# EAGLE design FeatherBigLatchingRelay (EAGLE 7.4.0)
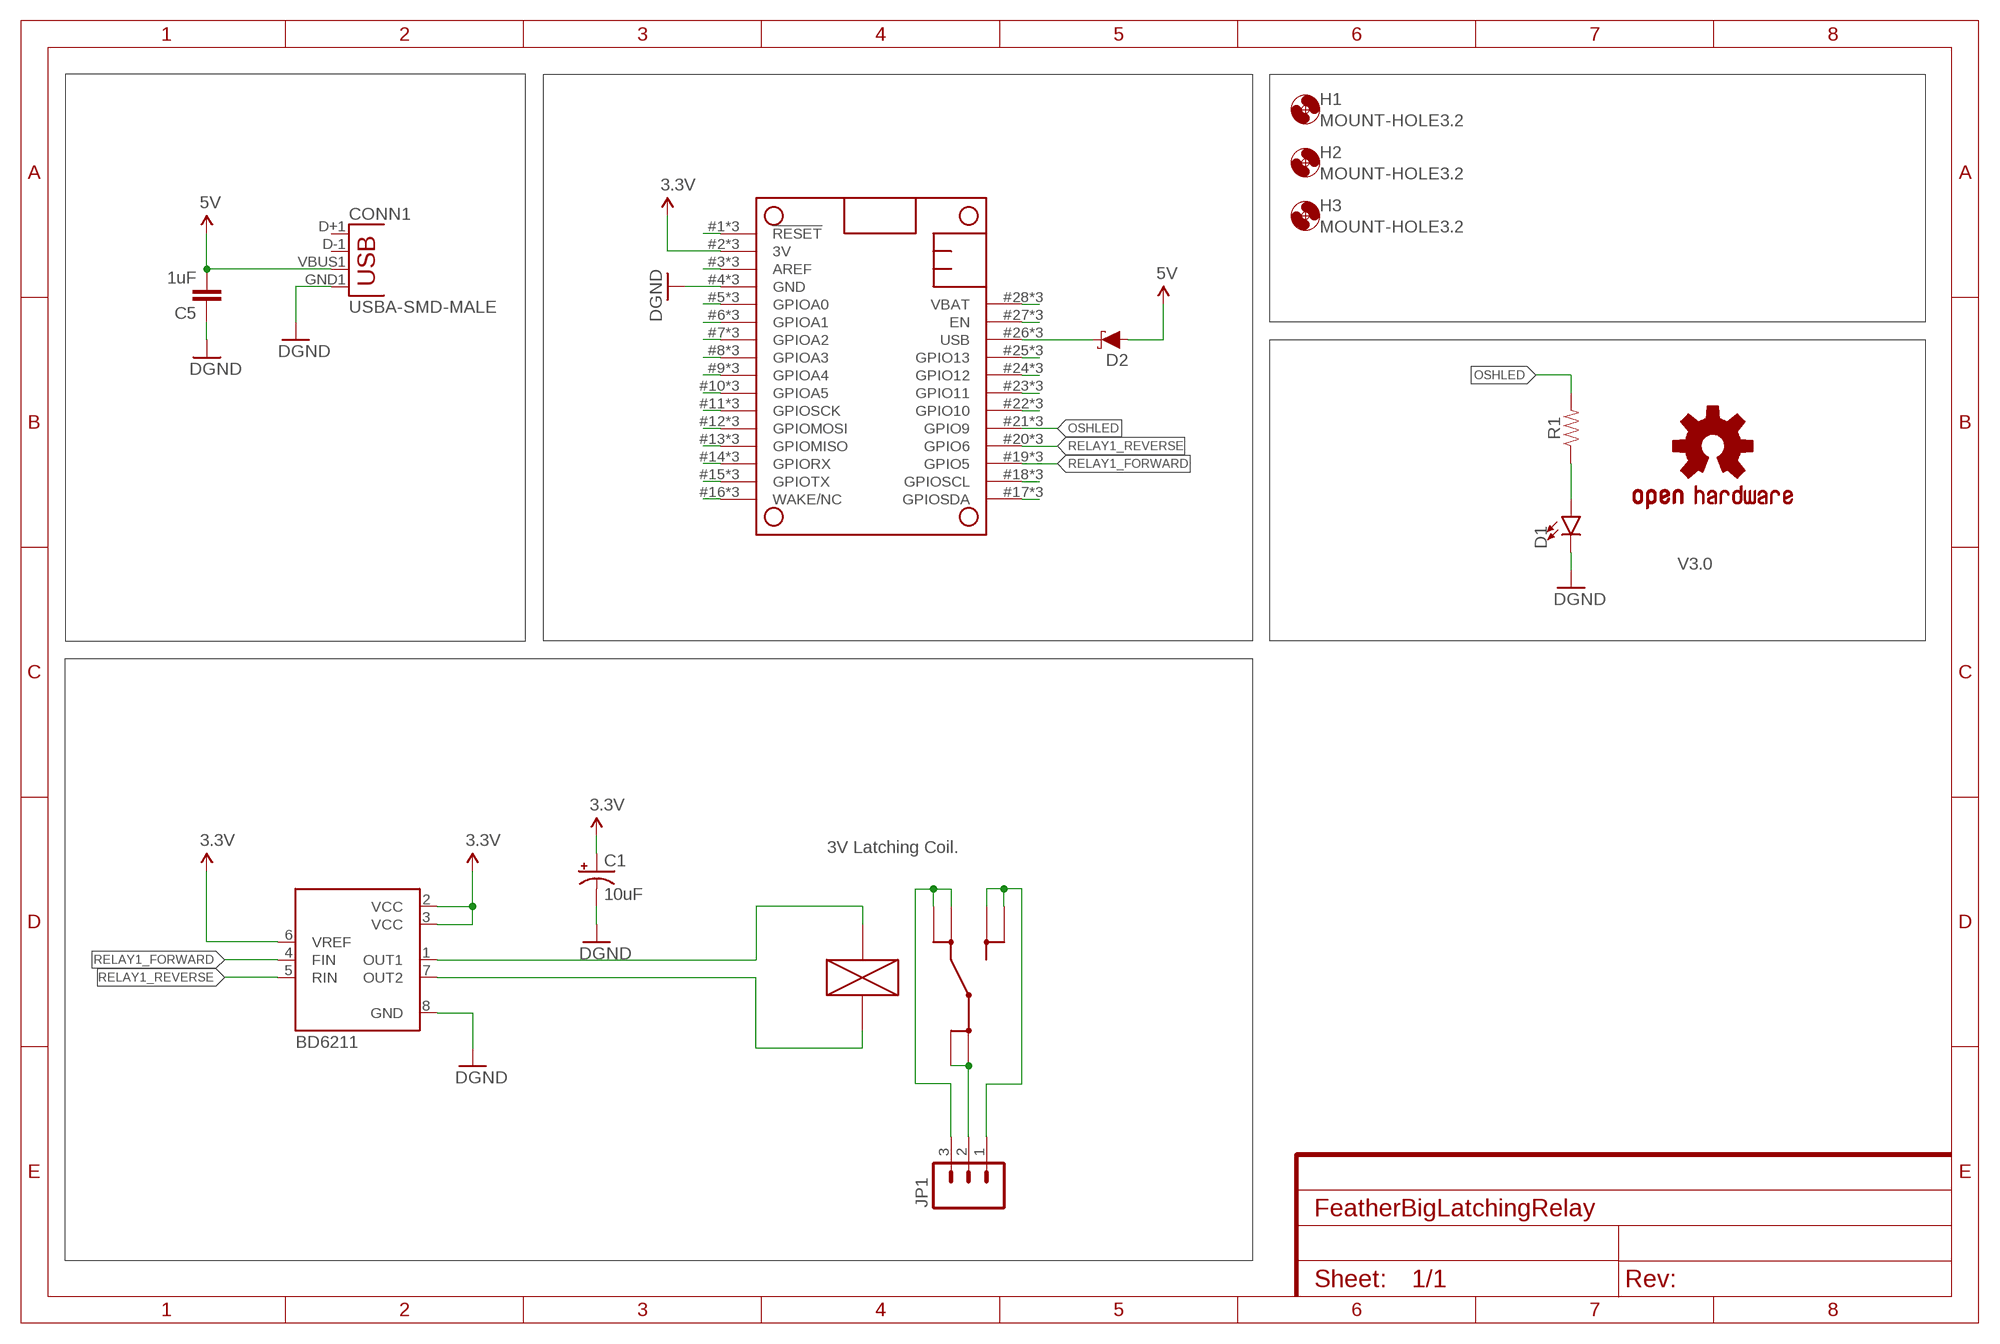
[diagram p0: schematic, sheet 1]

## Parts
C1  10uF  10UF-16V-10%(TANT)  [EIA3216]
C5  1uF  CAP0805  [0805]
CONN1  USBA-SMD-MALE  [USB-A-SMT-MALE]
D1  LED1206-BOTTOM  [LED-1206-BOTTOM]
D2  3A/40V/500mV  DIODE-SCHOTTKY-B340A  [SMA-DIODE]
H1  MOUNT-HOLE3.2  [3,2]
H2  MOUNT-HOLE3.2  [3,2]
H3  MOUNT-HOLE3.2  [3,2]
JP1  M03-SCREW-5MM  [SCREWTERMINAL-5MM-3]
LOGO1  OSHW-LOGOM  [OSHW-LOGO-M]
MS1  FEATHERWINGFEATHERWING_BREAKOUT_INSIDEONLY  [FEATHERWING_BREAKOUT_INSIDE_ONLY]
R1  RESISTOR1206  [1206]
U3  BD6211F  [SOP8]
U$1  RELAY_G5RL-1E  [G5RL-1E]

## Nets
3.3V: C1.A(+) MS1.2(3V) MS1.#2(3V) MS1.@2(3V) U3.2(VCC) U3.3(VCC) U3.6(VREF)
5V: C5.2 CONN1.VBUS1(VBUS) D2.A
GND: C1.C(-) C5.1 CONN1.GND1(GND) D1.C MS1.4(GND) MS1.#4(GND) MS1.@4(GND) U3.8(GND) ; supply symbol labelled DGND
N$1: JP1.2 U$1.COM@1(COM) U$1.COM@2(COM)
N$3: JP1.1 U$1.NO@1(NO) U$1.NO@2(NO)
N$4: JP1.3 U$1.NC@1(NC) U$1.NC@2(NC)
N$11: D1.A R1.1
N$12: U3.1(OUT1) U$1.COIL+
N$13: U3.7(OUT2) U$1.COIL-
N$30: MS1.22(GPIO10) MS1.#22(GPIO10) MS1.@22(GPIO10)
N$49: MS1.23(GPIO11) MS1.#23(GPIO11) MS1.@23(GPIO11)
N$50: MS1.24(GPIO12) MS1.#24(GPIO12) MS1.@24(GPIO12)
N$51: MS1.25(GPIO13) MS1.#25(GPIO13) MS1.@25(GPIO13)
N$52: MS1.27(EN) MS1.#27(EN) MS1.@27(EN)
N$53: MS1.1(!RESET) MS1.#1(!RESET) MS1.@1(!RESET)
N$54: MS1.3(AREF) MS1.#3(AREF) MS1.@3(AREF)
N$55: MS1.5(GPIOA0) MS1.#5(GPIOA0) MS1.@5(GPIOA0)
N$56: MS1.6(GPIOA1) MS1.#6(GPIOA1) MS1.@6(GPIOA1)
N$57: MS1.7(GPIOA2) MS1.#7(GPIOA2) MS1.@7(GPIOA2)
N$58: MS1.8(GPIOA3) MS1.#8(GPIOA3) MS1.@8(GPIOA3)
N$59: MS1.9(GPIOA4) MS1.#9(GPIOA4) MS1.@9(GPIOA4)
N$60: MS1.10(GPIOA5) MS1.#10(GPIOA5) MS1.@10(GPIOA5)
N$61: MS1.11(GPIOSCK) MS1.#11(GPIOSCK) MS1.@11(GPIOSCK)
N$62: MS1.12(GPIOMOSI) MS1.#12(GPIOMOSI) MS1.@12(GPIOMOSI)
N$63: MS1.13(GPIOMISO) MS1.#13(GPIOMISO) MS1.@13(GPIOMISO)
N$64: MS1.14(GPIORX) MS1.#14(GPIORX) MS1.@14(GPIORX)
N$65: MS1.15(GPIOTX) MS1.#15(GPIOTX) MS1.@15(GPIOTX)
N$66: MS1.16(WAKE/NC) MS1.#16(WAKE/NC) MS1.@16(WAKE/NC)
N$67: MS1.17(GPIOSDA) MS1.#17(GPIOSDA) MS1.@17(GPIOSDA)
N$68: MS1.18(GPIOSCL) MS1.#18(GPIOSCL) MS1.@!8(GPIOSCL)
OSHLED: MS1.21(GPIO9) MS1.#21(GPIO9) MS1.@21(GPIO9) R1.2
RELAY1_FORWARD: MS1.19(GPIO5) MS1.#19(GPIO5) MS1.@19(GPIO5) U3.4(FIN)
RELAY1_REVERSE: MS1.20(GPIO6) MS1.#20(GPIO6) MS1.@20(GPIO6) U3.5(RIN)
USB: D2.C MS1.26(USB) MS1.#26(USB) MS1.@26(USB)
VBAT: MS1.28(VBAT) MS1.#28(VBAT) MS1.@28(VBAT)
Unconnected: CONN1.D+1(D+) CONN1.D-1(D-)

## Notes on the sheet
- V3.0
- 3V Latching Coil.
- BD6211

## Library data of the parts
C1 = SparkFun-Capacitors:10UF-16V-10%(TANT): CAP-00811 1206/EIA-3216 Tantalum capacitor; PROD_ID: CAP-00811
C5 = SparkFun-Passives:CAP: Capacitor Standard 0603 ceramic capacitor, and 0.1" leaded capacitor.
CONN1 = SparkFun-Connectors:USB: USB Connectors USB-B-PTH is fully proven SKU : PRT-00139/CONN-08278 USB-miniB is fully proven SKU : PRT-00587 USB-A-PCB is untested. USB-A-H is throughly reviewed, but untested. Spark Fun Electronics SKU : PRT-00437 USB-B-SMT is throughly reviewed, but untested. Needs silkscreen touching up. USB-A-S has not been used/tested USB-MB-H has not been used/tested USB-MICROB has been used. CONN-09505
D1 = SparkFun-LED:LED: LED (Generic) Standard schematic elements and footprints for 5mm, 3mm, 1206, and 0603 sized LEDs. Generic LEDs with no color specified.
D2 = SparkFun-DiscreteSemi:DIODE-SCHOTTKY: Schottky diode A Schottky diode is a semiconductor diode which has a low forward voltage drop and a very fast switching action.; PROD_ID: DIO-09886
H1-H3 = holes:MOUNT-HOLE: MOUNTING HOLE with drill center marker
JP1 = SparkFun-Connectors:M03: Header 3 Standard 3-pin 0.1" header. Use with straight break away headers (SKU : PRT-00116), right angle break away headers (PRT-00553), swiss pins (PRT-00743), machine pins (PRT-00117), and female headers (PRT-00115). Molex polarized connector foot print use with SKU : PRT-08232 with associated crimp pins and housings.; STOREFRONT_ID: PRT-08433
LOGO1 = SparkFun-Aesthetics:OSHW-LOGO: Open-Source Hardware (OSHW) Logo This logo indicates the piece of hardware it is found on incorporates a OSHW license and/or adheres to the definition of open source hardware found here: http://freedomdefined.org/OSHW
MS1 = ThingySticks:FEATHERWING
R1 = SparkFun-Resistors:RESISTOR: Generic Resistor Package
U3 = BD6211F:BD6211F
U$1 = RELAY_G5RL-1E:RELAY_G5RL-1E

## Board
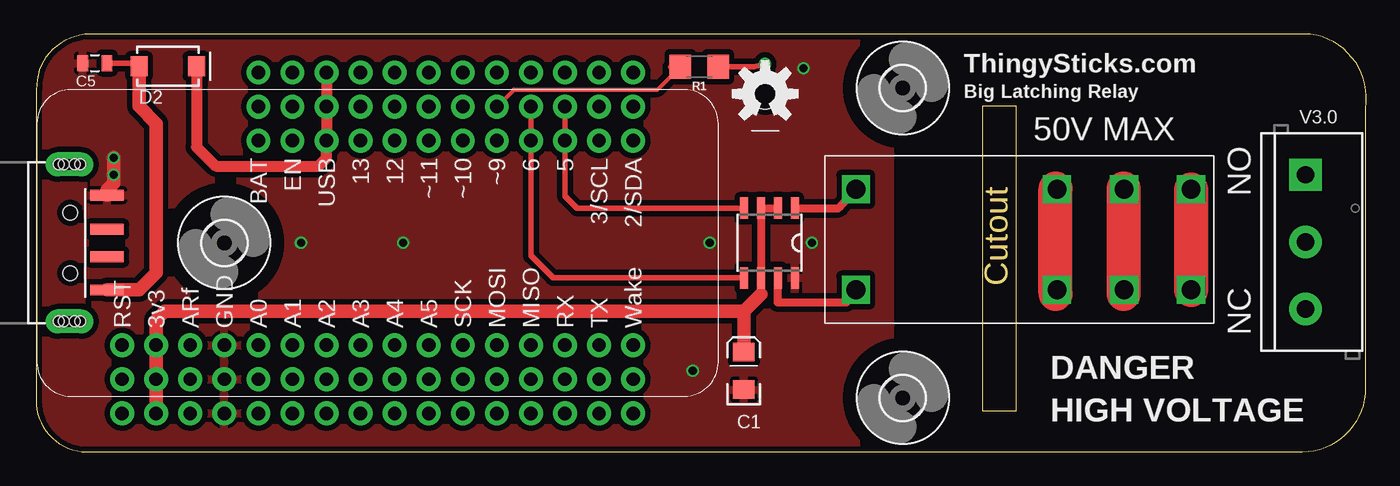
[diagram p1: board, top side]
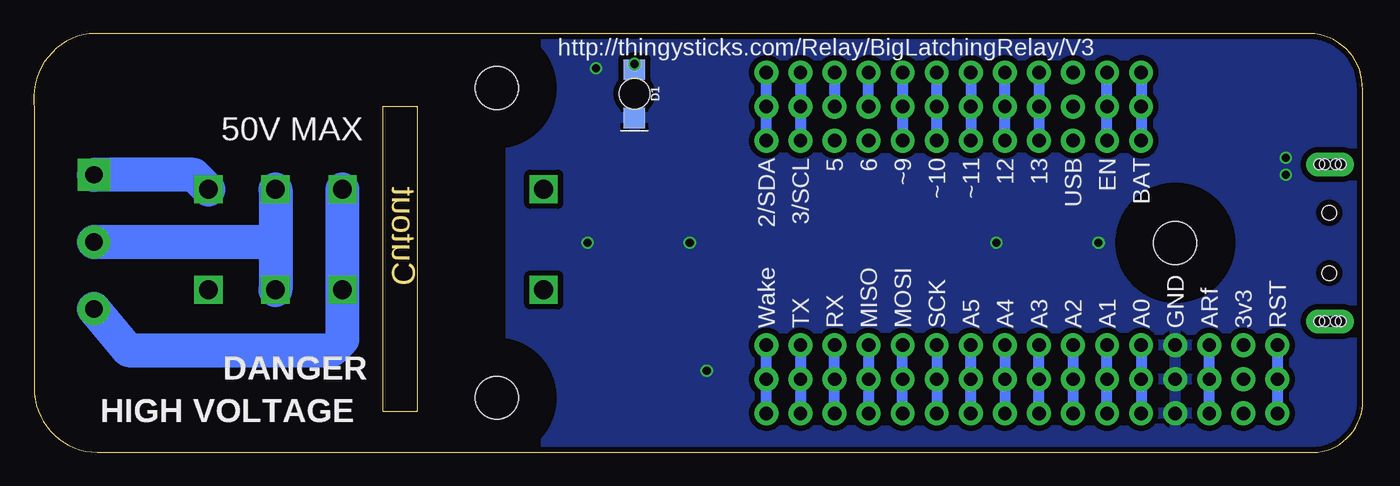
[diagram p2: board, bottom side, seen from below]

Size 99.09 x 31.22 mm. Coordinates in mm from the lower left corner, seen from the top.
Outline: 3.92,31.22 94.95,31.22 arc-90 99.04,25.66 99.04,4.82 arc-90 94.34,0.01 4.06,0.01 arc-90 0,3.55 0,27.04 arc-90 3.92,31.22
Outline: 70.48,25.79 70.48,3.07 73.03,3.07 73.03,25.79 70.48,25.79
Copper layers (1*16): Top 0.035mm / dielectric 1.5mm / Bottom 0.035mm
Design rules "dirt_cheap_dirty_boards.v1": minimum track width 5mil, minimum drill 12mil, track to track 5mil, track to pad 5mil, pad to pad 5mil, via to via 5mil, smd to smd 0mil, copper to edge 10mil, drill to drill 10mil, minimum pad ring 10mil, minimum via ring 6mil, stop-mask expansion 2mil, vias tented up to drill 25mil, thermal gap 10mil

### Footprints (pad centres in the part's own frame; a part is rotated, then mirrored left to right if it is on the bottom)
EIA3216 = smd 1.4 x 1.6: A 1.4,0; C -1.4,0
0805 = smd 0.8 x 1.2: 1 -0.9,0; 2 0.9,0
USB-A-SMT-MALE = smd 0.8 x 2.5: D+1 1.027,-5.87; D-1 -1.027,-5.87; GND1 3.551,-5.87; VBUS1 -3.5,-5.87 | drill 0.8 pad 1.778 long: P$1 5.85,-3.05; P$3 -5.85,-3.05 | hole 1.1: 2.25,-3.12; -2.25,-3.12 | hole 0.8: -5.85,-3.45; -5.85,-3.85; -5.85,-2.65; -5.85,-2.25; 5.85,-3.45; 5.85,-3.85; 5.85,-2.65; 5.85,-2.25
LED-1206-BOTTOM = smd 1.5 x 1.6: A -1.8,0; C 1.8,0 | hole 2.3: 0,0
SMA-DIODE = smd 1.27 x 1.47: A -2.15,0; C 2.15,0
3,2 = hole 3.2: 0,0
SCREWTERMINAL-5MM-3 = drill 1.3 pad 2.413 square: 1 0,0 | drill 1.3 pad 2.413: 2 5,0; 3 10,0
FEATHERWING_BREAKOUT_INSIDE_ONLY = drill 1 pad 1.778: 1 6.35,1.27; 2 8.89,1.27; 3 11.43,1.27; 4 13.97,1.27; 5 16.51,1.27; 6 19.05,1.27; 7 21.59,1.27; 8 24.13,1.27; 9 26.67,1.27; 10 29.21,1.27; 11 31.75,1.27; 12 34.29,1.27; 13 36.83,1.27; 14 39.37,1.27; 15 41.91,1.27; 16 44.45,1.27; 17 44.45,21.59; 18 41.91,21.59; 19 39.37,21.59; 20 36.83,21.59; 21 34.29,21.59; 22 31.75,21.59; 23 29.21,21.59; 24 26.67,21.59; 25 24.13,21.59; 26 21.59,21.59; 27 19.05,21.59; 28 16.51,21.59; #1 6.35,3.81; #2 8.89,3.81; #3 11.43,3.81; #4 13.97,3.81; #5 16.51,3.81; #6 19.05,3.81; #7 21.59,3.81; #8 24.13,3.81; #9 26.67,3.81; #10 29.21,3.81; #11 31.75,3.81; #12 34.29,3.81; #13 36.83,3.81; #14 39.37,3.81; #15 41.91,3.81; #16 44.45,3.81; #17 44.45,19.05; #18 41.91,19.05; #19 39.37,19.05; #20 36.83,19.05; #21 34.29,19.05; #22 31.75,19.05; #23 29.21,19.05; #24 26.67,19.05; #25 24.13,19.05; #26 21.59,19.05; #27 19.05,19.05; #28 16.51,19.05; @1 6.35,-1.27; @2 8.89,-1.27; @3 11.43,-1.27; @4 13.97,-1.27; @5 16.51,-1.27; @6 19.05,-1.27; @7 21.59,-1.27; @8 24.13,-1.27; @9 26.67,-1.27; @10 29.21,-1.27; @11 31.75,-1.27; @12 34.29,-1.27; @13 36.83,-1.27; @14 39.37,-1.27; @15 41.91,-1.27; @16 44.45,-1.27; @17 44.45,24.13; @19 39.37,24.13; @20 36.83,24.13; @21 34.29,24.13; @22 31.75,24.13; @23 29.21,24.13; @24 26.67,24.13; @25 24.13,24.13; @26 21.59,24.13; @27 19.05,24.13; @28 16.51,24.13; @!8 41.91,24.13
1206 = smd 1.6 x 1.8: 1 -1.4,0; 2 1.4,0
SOP8 = smd 0.6 x 1.6: 1 -1.905,-2.6; 2 -0.635,-2.6; 3 0.635,-2.6; 4 1.905,-2.6; 5 1.905,2.6; 6 0.635,2.6; 7 -0.635,2.6; 8 -1.905,2.6
G5RL-1E = drill 1.4 square: COIL+ -10.7,4; COIL- -10.7,-3.5; COM@1 9.3,4; COM@2 9.3,-3.5; NC@1 4.3,4; NC@2 4.3,-3.5; NO@1 14.3,4; NO@2 14.3,-3.5

### Placement (x,y rotation side)
C1  52.7,6.09 90 top
C5  4.32,29.01 0 top
CONN1  -0.63,15.61 90 top
D1  54.29,26.73 270 bottom
D2  9.76,28.78 0 top
H1  13.97,15.61 0 top
H2  64.56,27.16 0 top
H3  64.56,4.07 180 top
JP1  94.59,20.69 270 top
LOGO1  54.29,26.73 0 top
MS1  0,4.18 0 top
R1  49.38,28.74 180 top
U3  54.61,15.61 180 top
U$1  71.76,15.61 0 top

### Tracks (layer width: path | path; a pad name or v marks a point on that pad's centre or on a via)
3.3V
  Top 0.61: U3.2 U3.3 U3.6 53.98,11.8
  Top 1.016: 52.7,10.53 9.53,10.53 8.89,9.9 MS1.#2 MS1.2 MS1.@2 | C1.A 52.7,10.53 | 52.7,10.53 53.98,11.8
5V
  Top 0.406: C5.2 7.38,29.01 D2.A
  Top 1.016: CONN1.VBUS1 7.62,12.11 8.88,13.37 8.89,24.5 7.61,25.78 D2.A
GND  (via drill 0.6)
  Top 1.016: CONN1.GND1 5.24,19.58 5.71,20.06 v5.71,20.69 v5.71,21.96
  other vias: 57.15,28.63 19.68,15.61 50.16,15.61 57.79,15.61 27.3,15.61 48.9,6.09
  pour Bottom (isolate 0.406): 0,31.36 63.5,31.36 63.5,-0.26 38.48,-0.14 0,-0.14
  pour Top (isolate 0.406): 0,31.17 63.62,31.49 63.62,-0.26 0,-0.26
N$1
  Bottom 2.54: JP1.2 81.06,15.69 | U$1.COM@1 81.06,15.69 | U$1.COM@2 81.06,15.61 81.06,15.69
N$3
  Top 2.54: U$1.NO@2 U$1.NO@1
  Bottom 2.54: U$1.NO@1 87.14,20.69 JP1.1
N$4
  Bottom 2.54: U$1.NC@1 U$1.NC@2 76.06,8.41 76.84,7.63 92.03,7.63 JP1.3
N$11  (via drill 0.6)
  Top 0.406: R1.1 53.45,28.74 v54.29,28.95
  Bottom 0.406: v54.29,28.95 D1.A
N$12
  Top 0.61: U3.1 59.79,18.21 U$1.COIL+
N$13
  Top 0.61: U$1.COIL- 60.96,12.11 60.32,11.17 55.24,11.17 U3.7
N$19
  Top 2.54: 75.95,11.82 75.95,19.67
N$27
  Top 2.54: 81.03,11.82 81.03,19.67
N$30
  Bottom 0.813: MS1.#22 MS1.22 MS1.@22
N$49
  Bottom 0.813: MS1.@23 MS1.23 MS1.#23
N$50
  Bottom 0.813: MS1.#24 MS1.24 MS1.@24
N$51
  Bottom 0.813: MS1.@25 MS1.25 MS1.#25
N$52
  Bottom 0.813: MS1.#27 MS1.27 MS1.@27
N$53
  Bottom 0.813: MS1.#1 MS1.1 MS1.@1
N$54
  Bottom 0.813: MS1.@3 MS1.3 MS1.#3
N$55
  Bottom 0.813: MS1.#5 MS1.5 MS1.@5
N$56
  Bottom 0.813: MS1.@6 MS1.6 MS1.#6
N$57
  Bottom 0.813: MS1.#7 MS1.7 MS1.@7
N$58
  Bottom 0.813: MS1.@8 MS1.8 MS1.#8
N$59
  Bottom 0.813: MS1.#9 MS1.9 MS1.@9
N$60
  Bottom 0.813: MS1.@10 MS1.10 MS1.#10
N$61
  Bottom 0.813: MS1.#11 MS1.11 MS1.@11
N$62
  Bottom 0.813: MS1.@12 MS1.12 MS1.#12
N$63
  Bottom 0.813: MS1.#13 MS1.13 MS1.@13
N$64
  Bottom 0.813: MS1.@14 MS1.14 MS1.#14
N$65
  Bottom 0.813: MS1.#15 MS1.15 MS1.@15
N$66
  Bottom 0.813: MS1.@16 MS1.16 MS1.#16
N$67
  Bottom 0.813: MS1.#17 MS1.17 MS1.@17
N$68
  Bottom 0.813: MS1.@!8 MS1.18 MS1.#18
OSHLED
  Top 0.305: 47.2,28.74 R1.2 46.28,27.04 35.56,27.04 MS1.21
  Bottom 0.813: MS1.@21 MS1.21 MS1.#21
RELAY1_FORWARD
  Top 0.406: U3.4 40.26,18.21 39.37,19.1 MS1.#19 MS1.19
  Bottom 0.813: MS1.@19 MS1.19
RELAY1_REVERSE
  Top 0.406: U3.5 38.48,13.01 36.83,14.66 MS1.#20 MS1.20
  Bottom 0.813: MS1.20 MS1.@20
USB
  Top 0.813: MS1.@26 MS1.26 MS1.#26 21.59,21.96 20.95,21.33 13.33,21.33 11.91,22.75 D2.C
VBAT
  Bottom 0.813: MS1.@28 MS1.28 MS1.#28

### Text on the board
Dimension: Cutout
tNames: ThingySticks.com | Big Latching Relay | V3.0 | 50V MAX | NO | NC | DANGER | HIGH VOLTAGE
bNames: http://thingysticks.com/Relay/BigLatchingRelay/V3 | 50V MAX | DANGER | HIGH VOLTAGE